# EAGLE design STB_FFA_SCH (EAGLE 6.4)
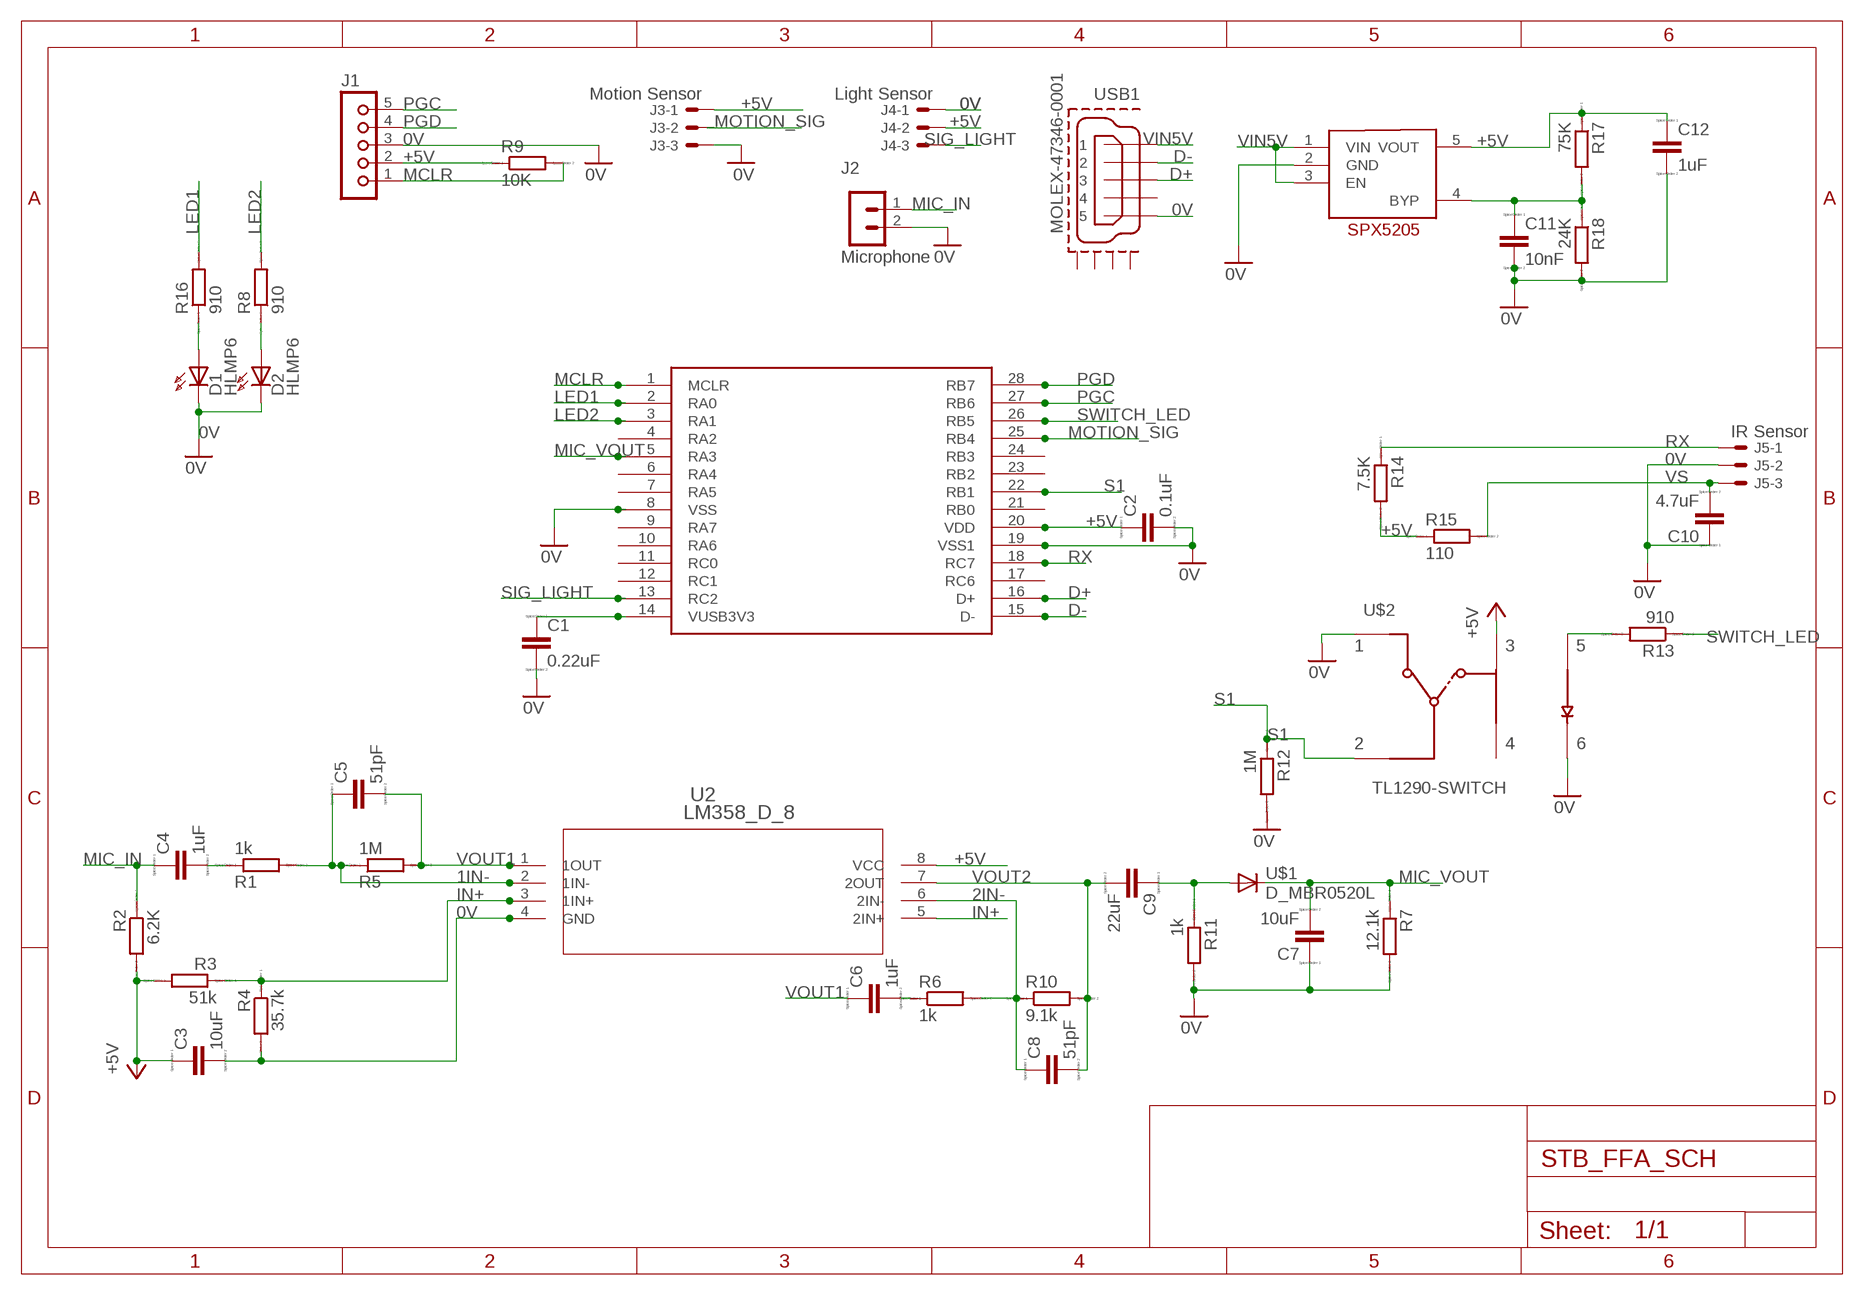
[diagram p0: schematic, sheet 1]

## Parts
C1  0.22uF  C  [C0805]
C2  0.1uF  C  [C0805]
C3  10uF  C  [C0805]
C4  1uF  C  [C0805]
C5  51pF  C  [C0805]
C6  1uF  C  [C0805]
C7  10uF  C  [C0805]
C8  51pF  C  [C0805]
C9  22uF  C  [C0805]
C10  4.7uF  C  [C0805]
C11  10nF  C  [C0805]
C12  1uF  C  [C0805]
D1  HLMP6  [HLMP6]
D2  HLMP6  [HLMP6]
J1  JU05  [JU05]
J2  Microphone  MA02-1  [MA02-1]
J3  Motion Sensor  22-23-2031  [22-23-2031]
J4  Light Sensor  22-23-2031  [22-23-2031]
J5  IR Sensor  22-23-2031  [22-23-2031]
R1  1k  R  [R0805]
R2  6.2K  R  [R0805]
R3  51k  R  [R0805]
R4  35.7k  R  [R0805]
R5  1M  R  [R0805]
R6  1k  R  [R0805]
R7  12.1k  R  [R0805]
R8  910  R  [R0805]
R9  10K  R  [R0805]
R10  9.1k  R  [R0805]
R11  1k  R  [R0805]
R12  1M  R  [R0805]
R13  910  R  [R0805]
R14  7.5K  R  [R0805]
R15  110  R  [R0805]
R16  910  R  [R0805]
R17  75K  R  [R0805]
R18  24K  R  [R0805]
U2  LM358_D_8  [D8]
U$1  D_MBR0520L  [D_MBR0520L]
U$2  TL1290-SWITCH  [TL1290-SWITCH]
U$3  SPX5205  [SOT23-5]
U$4  PIC18F25K500  [SSOP28]
USB1  MOLEX-47346-0001  [MOLEX-47364-0001]

## Nets
0V: C1.2 C2.2 C3.2 C7.1 C10.1 C11.2 C12.2 D1.K D2.K J1.3 J2.2 J3.3 J4.1 J5.2 R4.2 R7.2 R11.2 R12.2 R18.2 U2.4(GND) U$2.1 U$2.6 U$3.2(GND) U$4.8(VSS) U$4.19(VSS1) USB1.5
1IN-: C5.1 R1.2 R5.1 U2.2(1IN-)
2IN-: C8.1 R6.2 R10.1 U2.6(2IN-)
+5V: C2.1 C3.1 C12.1 J1.2 J3.1 J4.2 R2.2 R3.2 R9.1 R14.2 R15.1 R17.1 U2.8(VCC) U$2.3 U$3.5(VOUT) U$4.20(VDD)
D+: U$4.16(D+) USB1.3
D-: U$4.15(D-) USB1.2
IN+: R3.1 R4.1 U2.3(1IN+) U2.5(2IN+)
LED1: R16.2 U$4.2(RA0)
LED2: R8.2 U$4.3(RA1)
MCLR: J1.1 R9.2 U$4.1(MCLR)
MIC_IN: C4.1 J2.1 R2.1
MIC_VOUT: C7.2 R7.1 U$1.C U$4.5(RA3)
MOTION_SIG: U$4.25(RB4)
N$1: C1.1 U$4.14(VUSB3V3)
N$2: D2.A R8.1
N$3: C9.1 R11.1 U$1.A
N$4: C6.2 R6.1
N$5: R13.2 U$2.5
N$7: D1.A R16.1
N$9: C4.2 R1.1
N$11: C11.1 R17.2 R18.1 U$3.4(BYP)
PGC: J1.5 U$4.27(RB6)
PGD: J1.4 U$4.28(RB7)
RX: J5.1 R14.1 U$4.18(RC7)
S1: R12.1 U$2.2 U$4.22(RB1)
SIG_LIGHT: J4.3 U$4.13(RC2)
SWITCH_LED: R13.1 U$4.26(RB5)
VIN5V: U$3.1(VIN) U$3.3(EN) USB1.1
VOUT1: C5.2 C6.1 R5.2 U2.1(1OUT)
VOUT2: C8.2 C9.2 R10.2 U2.7(2OUT)
VS: C10.2 J5.3 R15.2
Unconnected: J3.2 U$2.4 U$4.4(RA2) U$4.6(RA4) U$4.7(RA5) U$4.9(RA7) U$4.10(RA6) U$4.11(RC0) U$4.12(RC1) U$4.17(RC6) U$4.21(RB0) U$4.23(RB2) U$4.24(RB3) USB1.4 USB1.GND1 USB1.GND2 USB1.GND3 USB1.GND4

## Library data of the parts
C1-C12 = eagle-ltspice:C: CAPACITOR, European symbol; SPICEMODEL: NONE; SPICEPREFIX: C
D1 D2 = display-hp:HLMP6: LED 2mm horizontal; MF: AGILENT TECHNOLOGIES; MPN: HLMP-6500; OC_FARNELL: 1652490; OC_NEWARK: 40K0088
J1 = con-lsta:JU05: PIN HEADER; OC_FARNELL: unknown; OC_NEWARK: unknown
J2 = CALPLUG:MA02-1
J3-J5 = con-molex:22-23-2031: .100" (2.54mm) Center Header - 3 Pin; MF: MOLEX; MPN: 22-23-2031; OC_FARNELL: 1462950; OC_NEWARK: 30C0862
R1-R18 = eagle-ltspice:R: RESISTOR, European symbol; SPICEMODEL: NONE; SPICEPREFIX: R
U2 = LM358:LM358_D_8: LM358 SOIC-8 TI; DATASHEETURL: http://www.ti.com/lit/gpn/LM358; DESCRIPTION: Dual Operational Amplifiers; FAMILY_NAME: STANDARD LINEAR AMPLIFIER; GENERIC_PART_NUMBER: LM358; INDUSTRY_STD_PKG_TYPE: SOIC; MANUFACTURER: Texas Instruments; PACKAGE_DESIGNATOR: D; PIN_COUNT: 8
U$1 = CALPLUG:D_MBR0520L
U$2 = CALPLUG:TL1290-SWITCH
U$3 = SPX5205:SPX5205
U$4 = pic18f25k50:PIC18F25K500
USB1 = usb_con-update:MOLEX-47346-0001: MICRO USB B, BOTTOM MOUNT

## Board
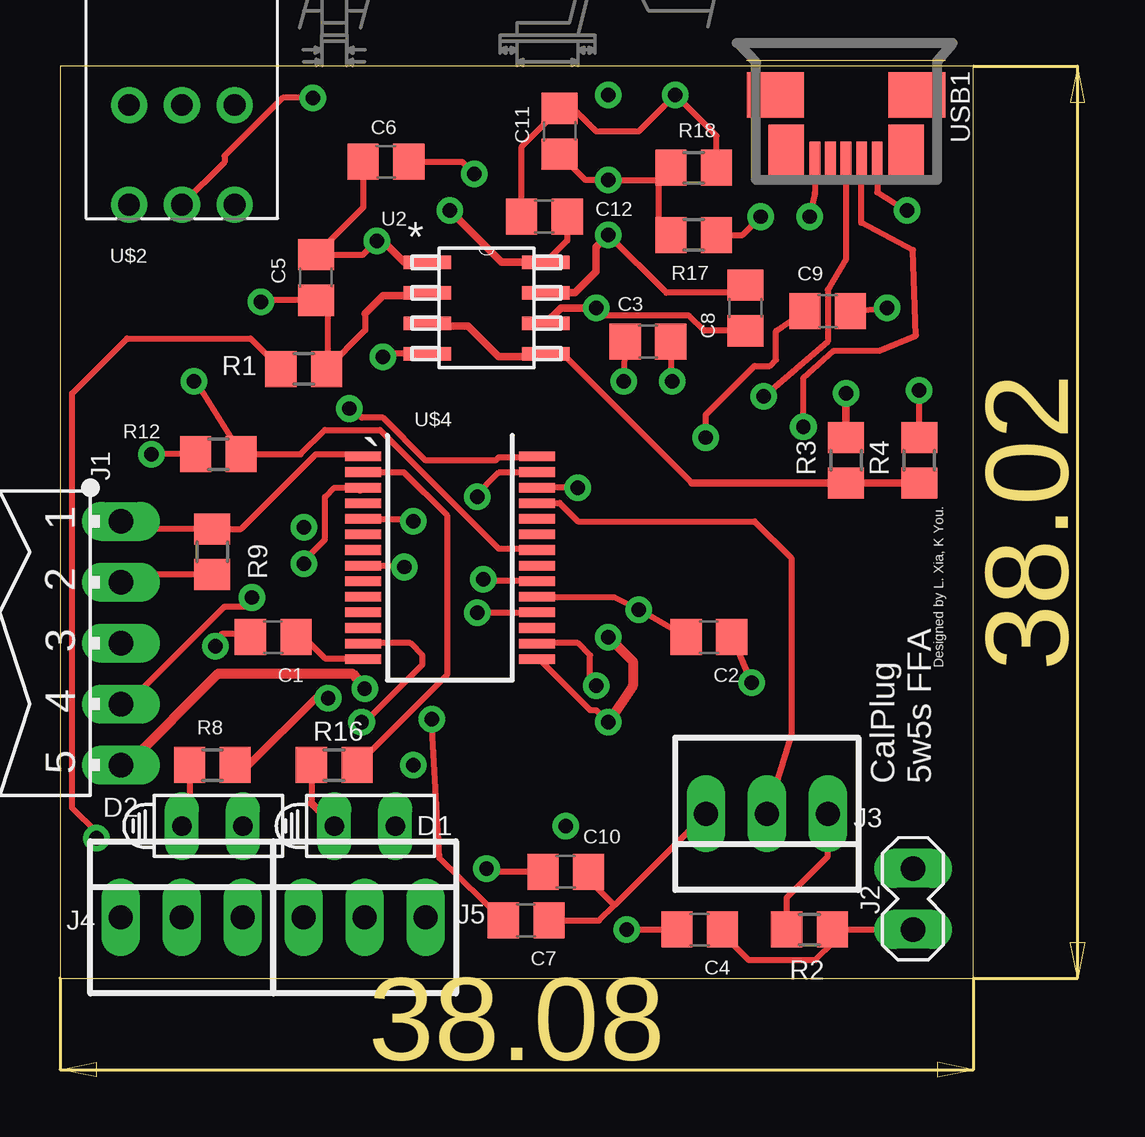
[diagram p1: board, top side]
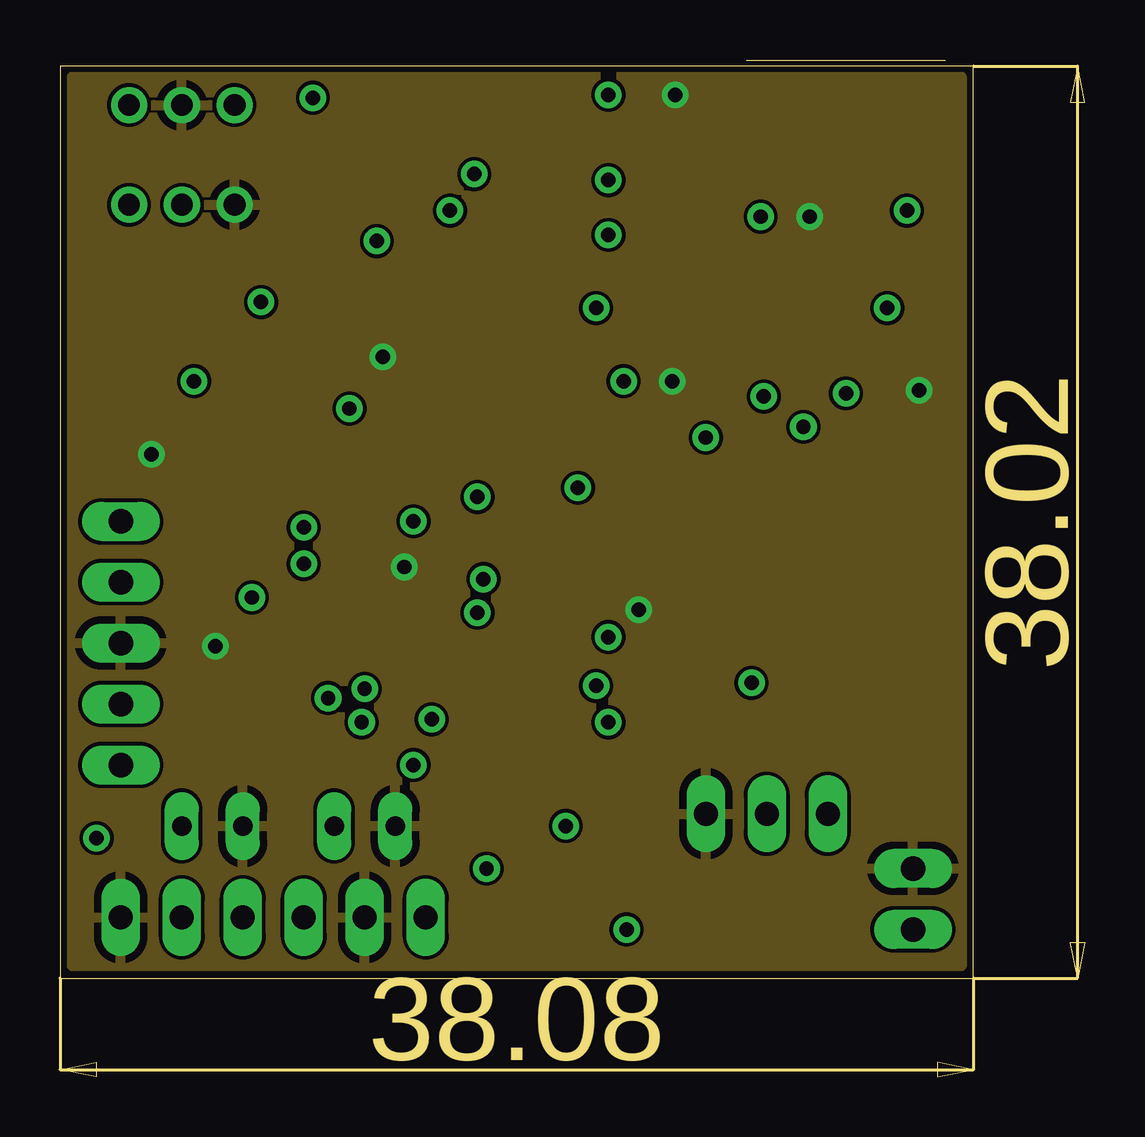
[diagram p2: board, inner layer Route2]
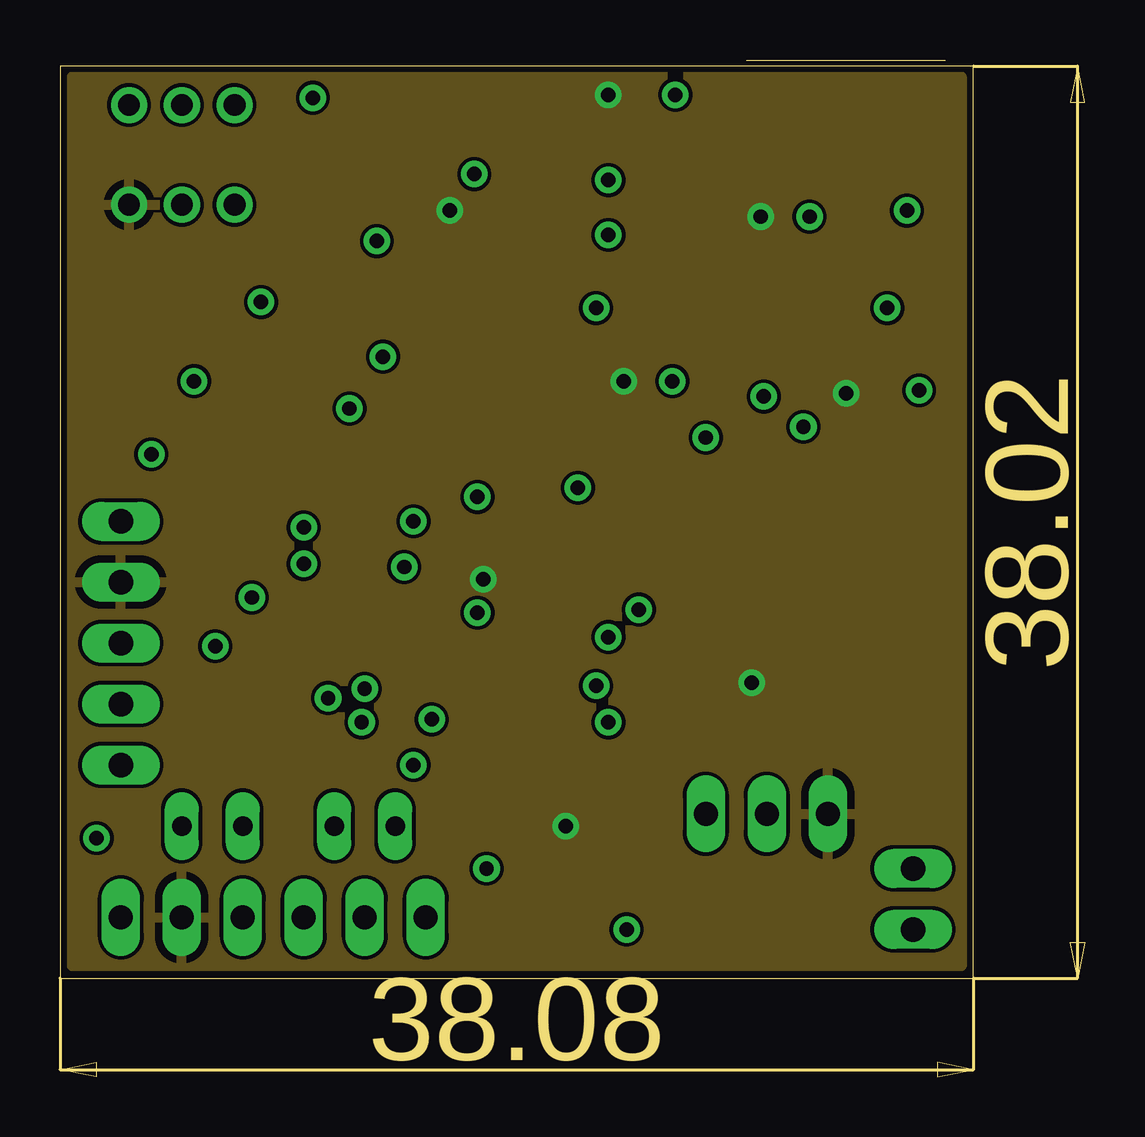
[diagram p3: board, inner layer Route15]
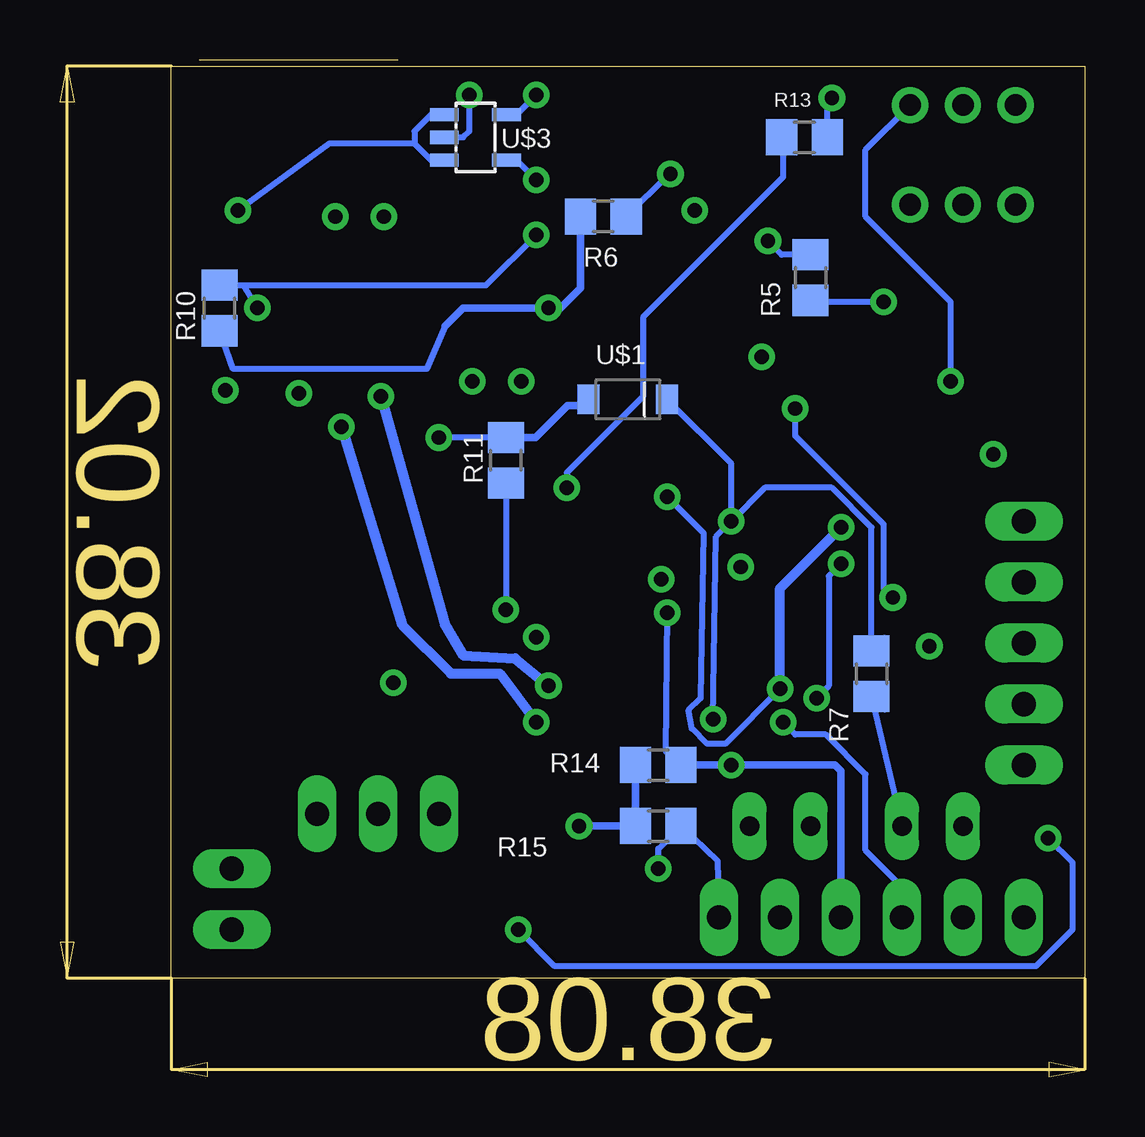
[diagram p4: board, bottom side, seen from below]

Size 38.08 x 38.02 mm. Coordinates in mm from the lower left corner, seen from the top.
Outline: 0,0 38.08,0 38.08,38.02 0,38.02 0,0
Copper layers (1*2*15*16): Top 0.035mm / dielectric 1.5mm / Route2 0.035mm / dielectric 0.15mm / Route15 0.035mm / dielectric 0.2mm / Bottom 0.035mm
Design rules "SparkFun-4-layer": minimum track width 6mil, minimum drill 13mil, track to track 6mil, track to pad 6mil, pad to pad 6mil, via to via 6mil, smd to smd 6mil, copper to edge 6mil, drill to drill 8mil, minimum pad ring 12mil, minimum via ring 10mil, stop-mask expansion 4mil, vias tented up to drill 20mil, thermal gap 12mil

### Footprints (pad centres in the part's own frame; a part is rotated, then mirrored left to right if it is on the bottom)
C0805 = smd 1.3 x 1.5: 1 -0.95,0; 2 0.95,0
HLMP6 = drill 0.813 long: A -1.27,0; K 1.27,0
JU05 = drill 1.016 long: 1 -5.08,0; 2 -2.54,0; 3 0,0; 4 2.54,0; 5 5.08,0
MA02-1 = drill 1.016 long: 1 -1.27,0; 2 1.27,0
22-23-2031 = drill 1 long: 1 -2.54,0; 2 0,0; 3 2.54,0
R0805 = smd 1.3 x 1.5: 1 -0.95,0; 2 0.95,0
D8 = smd 1.981 x 0.559: 1 -2.464,1.905; 2 -2.464,0.635; 3 -2.464,-0.635; 4 -2.464,-1.905; 5 2.464,-1.905; 6 2.464,-0.635; 7 2.464,0.635; 8 2.464,1.905
D_MBR0520L = smd 0.91 x 1.22: A 1.635,0; C -1.635,0
TL1290-SWITCH = drill 0.9: 1 2.2,-4.075; 2 2.2,0.075; 3 -2.2,-4.075; 4 -2.2,0.075; 5 0,-4.075; 6 0,0.075
SOT23-5 = smd 0.55 x 1.2: 1 -0.95,-1.3; 2 0,-1.3; 3 0.95,-1.3; 4 0.95,1.3; 5 -0.95,1.3
SSOP28 = smd 0.4 x 1.5: 1 -4.225,-3.625; 2 -3.575,-3.625; 3 -2.925,-3.625; 4 -2.275,-3.625; 5 -1.625,-3.625; 6 -0.975,-3.625; 7 -0.325,-3.625; 8 0.325,-3.625; 9 0.975,-3.625; 10 1.625,-3.625; 11 2.275,-3.625; 12 2.925,-3.625; 13 3.575,-3.625; 14 4.225,-3.625; 15 4.225,3.625; 16 3.575,3.625; 17 2.925,3.625; 18 2.275,3.625; 19 1.625,3.625; 20 0.975,3.625; 21 0.325,3.625; 22 -0.325,3.625; 23 -0.975,3.625; 24 -1.625,3.625; 25 -2.275,3.625; 26 -2.925,3.625; 27 -3.575,3.625; 28 -4.225,3.625
MOLEX-47364-0001 = smd 1.7 x 0.45: 1 2.8,1.3; 2 2.8,0.65; 3 2.8,0; 4 2.8,-0.65; 5 2.8,-1.3 | smd 1.9 x 2.375: GND1 0,2.95; GND4 0,-2.95 | smd 2.1 x 1.475: GND2 2.3,2.5; GND3 2.3,-2.5

### Placement (x,y rotation side)
C1  8.89,14.22 180 top
C2  27.05,14.22 180 top
C3  24.51,26.54 0 top
C4  26.67,2.03 180 top
C5  10.67,29.21 90 top
C6  13.59,34.04 0 top
C7  19.43,2.41 180 top
C8  28.57,27.94 90 top
C9  32,27.81 0 top
C10  21.08,4.45 180 top
C11  20.83,35.31 90 top
C12  20.19,31.75 180 top
D1  12.7,6.35 0 top
D2  6.35,6.35 0 top
J1  2.54,13.97 270 top
J2  35.56,3.3 90 top
J3  29.46,6.86 180 top
J4  5.08,2.54 0 top
J5  12.7,2.54 0 top
R1  10.16,25.4 0 top
R2  31.24,2.03 180 top
R3  32.77,21.59 90 top
R4  35.81,21.59 90 top
R5  11.43,29.21 90 bottom
R6  20.07,31.75 180 bottom
R7  8.89,12.7 270 bottom
R8  6.35,8.89 0 top
R9  6.35,17.78 90 top
R10  36.07,27.94 90 bottom
R11  24.13,21.59 270 bottom
R12  6.6,21.84 180 top
R13  11.68,35.05 0 bottom
R14  17.78,8.89 180 bottom
R15  17.78,6.35 0 bottom
R16  11.43,8.89 0 top
R17  26.42,30.99 180 top
R18  26.42,33.78 0 top
U2  17.78,27.94 0 top
U$1  19.05,24.13 180 bottom
U$2  5.08,36.32 0 top
U$3  25.4,35.05 270 bottom
U$4  16.26,17.53 270 top
USB1  32.77,36.83 270 top

### Tracks (layer width: path | path; a pad name or v marks a point on that pad's centre or on a via)
0V  (via drill 0.6)
  Top 0.254: R4.2 v35.81,24.51 | R12.2 v3.81,21.84 | U2.4 13.59,26.04 v13.46,25.91 | USB1.5 31.47,32.74 v31.24,31.75 | R18.2 27.37,35.12 v25.65,36.83 24.13,35.31 22.35,35.31 21.4,36.26 C11.2 19.24,34.67 C12.2 | C2.2 v24.13,15.37 23.11,15.88 19.91,15.88 U$4.19 | C3.2 25.46,24.96 v25.53,24.89 | C7.1 22.48,2.41 23.11,3.05 | 23.11,3.05 J3.3 | C1.2 8,14.22 8,14.35 6.73,14.35 6.73,14.1 v6.48,13.84 | U$4.8 14.29,17.2 v14.35,17.14 | C10.1 22.03,4.13 23.11,3.05
  Bottom 0.254: 8.34,11.2 R7.2 D2.K | U$3.2 25.91,35.05 25.65,35.31 v25.65,36.83 | R11.2 v24.13,15.37
  pour Route2: 0.51,37.59 37.59,37.59 37.59,0.51 0.51,0.51
1IN-  (via drill 0.6)
  Top 0.254: v8.38,28.19 8.45,28.26 C5.1 11.18,27.75 11.18,25.4 R1.2 12.72,27.01 12.72,27.71
  Top 0.305: 12.72,27.71 13.46,28.45 15.19,28.45 U2.2
  Bottom 0.254: v8.38,28.19 11.36,28.19 R5.1
2IN-  (via drill 0.6)
  Top 0.254: C8.1 26.86,26.99 26.23,27.62 22.67,27.62 v22.35,27.94
  Top 0.305: v22.35,27.94 20.88,27.94 U2.6
  Bottom 0.254: 26.67,27.18 27.43,25.4 35.49,25.4 R10.1 35.52,26.44
  Bottom 0.305: 21.02,32.19 R6.2 21.02,28.77 21.84,27.94 v22.35,27.94 25.91,27.94 26.67,27.18
+5V  (via drill 0.6)
  Top 0.254: R9.1 2.86,16.83 J1.2 | R17.1 28.45,30.99 v29.21,31.75 | C2.1 v28.83,12.32 | C3.1 v23.5,24.89 | U$4.20 17.74,16.55 v17.65,16.64 | C12.1 21.14,30.74 U2.8 | R2.2 30.29,3.37 32,5.08 J3.1
  Top 0.305: R3.2 v32.77,24.38 | U2.8 18.41,29.84 v16.26,32
  Bottom 0.254: U$3.5 23.69,36 v22.86,36.83
  Bottom 0.305: R14.2 R15.1 v21.08,6.35
  pour Route15: 0.51,37.59 37.59,37.59 37.59,0.51 0.51,0.51
D+  (via drill 0.6)
  Top 0.254: USB1.3 32.77,29.97 32,28.7 32,26.54 v29.34,24.26 | 22.1,12.19 22.1,13.46 21.59,13.97 19.9,13.97 U$4.16
  Top 0.406: v22.35,12.19 22.1,12.19
  Bottom 0.406: v29.34,24.26 26.67,14.73 25.91,13.46 23.75,13.34 v22.35,12.19
D-  (via drill 0.6)
  Top 0.254: U$4.15 19.97,13.3 22.1,11.18 22.35,11.18 v22.86,10.67 | v30.99,22.99 30.99,25.02 32.26,26.16 34.16,26.16 35.69,26.8 35.56,30.35 33.4,31.5 33.4,34.02 USB1.2
  Top 0.406: 22.84,14.21 v22.86,14.22 23.88,13.21 23.88,12.19 v22.86,10.67
  Bottom 0.406: v30.99,22.99 28.45,14.73 26.42,12.7 24.38,12.7 v22.86,10.67
IN+
  Top 0.254: U2.5 20.95,26.04 26.35,20.64
  Top 0.305: R4.1 R3.1 26.35,20.64 | U2.3 15.32,27.25 15.24,27.18 17.02,27.18 18.29,25.91 20.12,25.91 U2.5
LED1
  Top 0.254: U$4.2 14.33,21.1 16.13,19.3 16.13,12.64 R16.2
LED2  (via drill 0.6)
  Top 0.254: 12.5,20.32 U$4.3 11.43,20.45 11.05,20.07 11.05,18.29 10.16,17.4 v10.16,17.27
  Top 0.305: R8.2 7.87,8.89 10.67,11.68 v11.18,11.68
  Bottom 0.254: v10.16,17.27 10.67,16.76 10.67,12.19 v11.18,11.68
MCLR
  Top 0.254: J1.1 2.86,18.73 R9.2 7.55,18.73 10.67,21.84 12.54,21.84 U$4.1
MIC_IN
  Top 0.254: J2.1 R2.1 32.26,1.97 32.26,1.52 31.5,0.76 28.7,0.76 27.62,1.84 C4.1
MIC_VOUT  (via drill 0.6)
  Top 0.254: U$4.5 14.63,19.15 v14.73,19.05 | C7.2 15.81,5.01 v15.49,10.79
  Bottom 0.254: 8.34,14.2 R7.1 8.89,18.8 10.54,20.45 13.34,20.45 v14.73,19.05 | v14.73,19.05 14.73,21.45 U$1.C | v15.49,10.79 15.37,18.41 v14.73,19.05
MOTION_SIG
  Top 0.254: U$4.25 19.94,19.81 20.83,19.81 21.59,19.05 28.96,19.05 30.48,17.53 30.48,10.16 29.46,6.86
N$1
  Top 0.254: C1.1 10.16,14.22 11.05,13.34 12.6,13.34 U$4.14
N$2
  Top 0.254: R8.1 5.4,6.67 D2.A
N$3  (via drill 0.6)
  Top 0.254: v26.92,22.54 26.92,23.5 28.96,25.53 29.59,25.53 29.84,25.78 29.84,26.98 C9.1
  Bottom 0.152: 20.32,24.13 U$1.A
  Bottom 0.254: R11.1 v26.92,22.54
  Bottom 0.305: U$1.A 20.68,24.02 20.83,23.88 21.57,23.88 22.9,22.54 R11.1
N$4  (via drill 0.6)
  Top 0.254: C6.2 16.76,34.04 v17.27,33.53
  Bottom 0.152: 19.05,31.75 R6.1
  Bottom 0.254: 19.05,31.82 R6.1 17.34,33.53 v17.27,33.53
N$5  (via drill 0.6)
  Top 0.254: v10.54,36.7 9.27,36.7 6.86,34.29 6.86,34.02 U$2.5
  Bottom 0.254: R13.2 10.73,36.51 v10.54,36.7
N$7
  Top 0.254: R16.1 10.48,7.3
  Top 0.305: 10.48,7.3 D1.A
N$9  (via drill 0.6)
  Top 0.254: v1.52,5.84 1.52,6.1 0.51,7.11 0.51,24.38 2.79,26.67 7.94,26.67 R1.1 | v23.62,2.03 C4.2
  Bottom 0.254: v1.52,5.84 0.51,4.83 0.51,2.03 2.03,0.51 22.1,0.51 v23.62,2.03
N$11  (via drill 0.6)
  Top 0.254: C11.1 21.91,33.27 v22.86,33.27 24.96,33.27 | 24.96,33.27 R18.1 | 24.96,33.27 24.96,31.5 R17.2
  Bottom 0.254: U$3.4 23.69,34.1 v22.86,33.27
PGC  (via drill 0.6)
  Top 0.254: U$4.27 19.81,21.08 18.29,21.08 17.27,20.07 v17.4,20.07
  Top 0.406: J1.5 2.79,8.89 6.6,12.7 12.19,12.7 v12.7,12.06
  Bottom 0.254: v17.4,20.07 15.88,18.54 16,11.68 16.51,11.18 16.38,10.41 15.75,9.78 14.99,9.78 v12.7,12.06
  Bottom 0.406: v12.7,12.06 12.7,16.26 v10.16,18.8
PGD  (via drill 0.6)
  Top 0.254: J1.4 2.79,11.43 6.86,15.49 7.75,15.49 8.06,15.81 v8,15.88 | U$4.28 19.81,21.72 18.29,21.72 18.16,21.59 15.24,21.59 13.46,23.37 12.57,23.37 12.19,23.75 v12.06,23.75
  Bottom 0.254: v12.06,23.75 12.06,22.61 8.38,18.92 8.38,16.26 v8,15.88
RX  (via drill 0.6)
  Top 0.254: v17.4,15.24 U$4.18
  Bottom 0.254: R14.1 17.46,9.46 v17.4,15.24
  Bottom 0.305: R14.1 v14.73,8.89 10.41,8.89 10.16,8.64 J5.1
S1  (via drill 0.6)
  Top 0.254: v5.59,24.89 5.84,24.64 5.84,24.57 R12.1 10.03,21.84 11.05,22.86 13.34,22.86 18.29,17.91 19.82,17.91 U$4.22
  Bottom 0.254: v5.59,24.89 5.59,28.19 9.14,31.75 9.14,34.53 U$2.2
SIG_LIGHT  (via drill 0.6)
  Top 0.254: v12.57,10.67 12.7,10.67 15.11,13.08 15.11,13.46 14.61,13.97 12.65,13.97 U$4.13
  Bottom 0.254: J4.3 7.62,3.81 9.14,5.33 9.14,8.51 10.79,10.16 12.06,10.16 v12.57,10.67
SWITCH_LED  (via drill 0.6)
  Top 0.254: v21.59,20.45 U$4.26
  Bottom 0.254: R13.1 12.57,35.05 12.57,33.4 18.41,27.56 18.41,24.26 21.59,21.08 v21.59,20.45 21.72,20.45
VIN5V  (via drill 0.6)
  Top 0.254: USB1.1 34.07,32.77 v35.31,32
  Bottom 0.254: U$3.1 27.24,36 27.94,35.31 27.94,34.8 | 27.94,34.8 27.18,34.04 26.77,34.04 U$3.3 | 27.94,34.8 31.5,34.8 v35.31,32
VOUT1  (via drill 0.6)
  Top 0.254: v13.21,30.73 12.63,30.16 C5.2 12.64,32.13 C6.1
  Top 0.305: U2.1 14.35,29.84 13.46,30.73 v13.21,30.73
  Bottom 0.254: R5.2 12.63,30.16 v13.21,30.73
VOUT2  (via drill 0.6)
  Top 0.254: C9.2 v34.48,27.94 | C8.2 28.13,28.57 25.27,28.57 v22.86,30.99
  Top 0.305: U2.7 21.46,28.57 22.35,29.46 22.35,30.48 v22.86,30.99
  Bottom 0.254: R10.2 35.05,28.89 | 35.05,28.89 24.96,28.89 v22.86,30.99 | v34.48,27.94 35.05,28.89
  Bottom 0.305: v22.86,30.99 22.86,30.71
VS  (via drill 0.6)
  Top 0.254: C10.2 17.91,4.45 v17.78,4.57
  Bottom 0.254: J5.3 15.31,4.89 R15.2 17.78,5.4 v17.78,4.57

### Text on the board
tNames: ` | Designed by L. Xia, K You. | CalPlug | 5w5s FFA